# EAGLE design light_sensor (EAGLE 7.3.0)
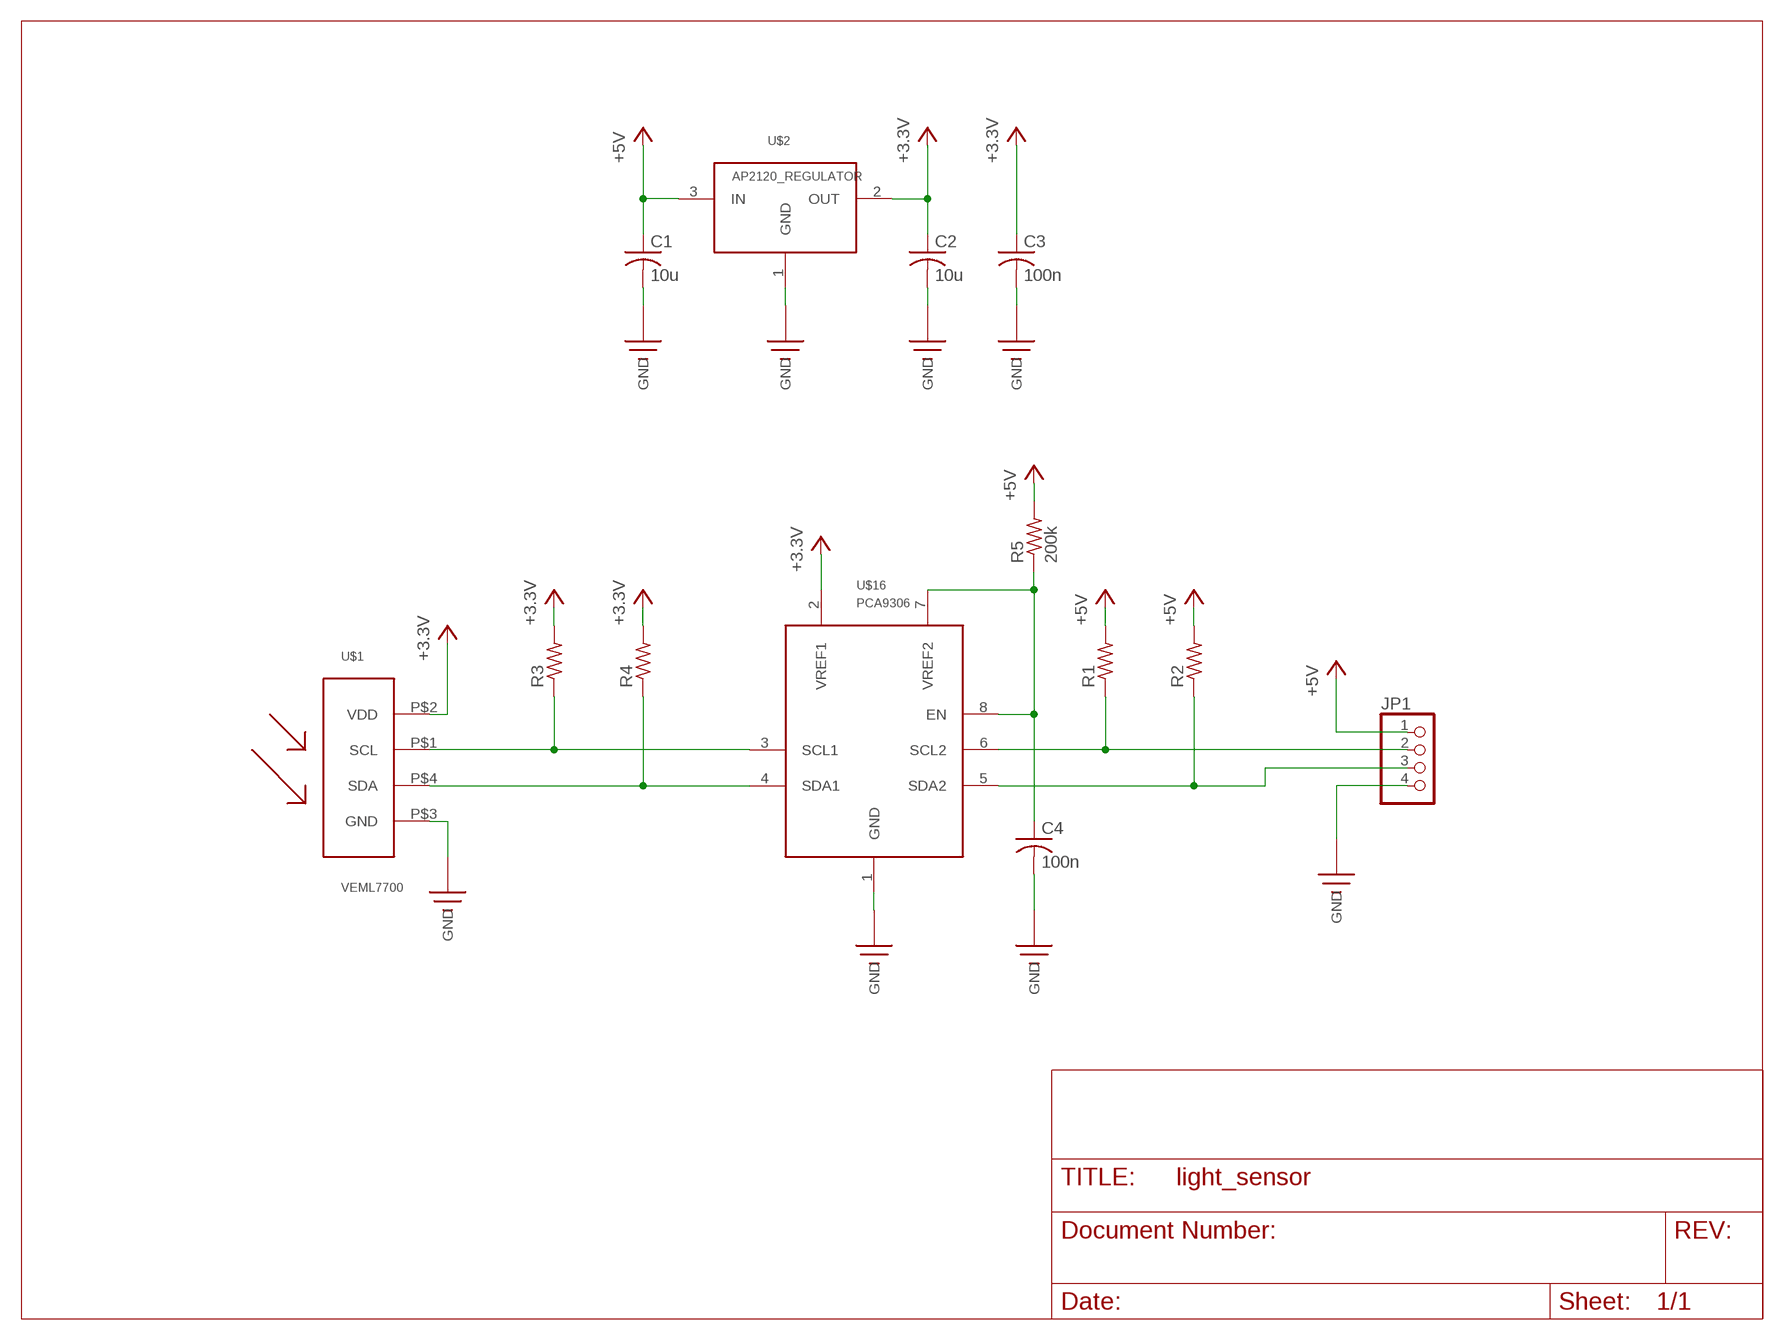
[diagram p0: schematic, sheet 1]

## Parts
C1  10u  C-USC1206K  [C1206K]
C2  10u  C-USC1206K  [C1206K]
C3  100n  C-USC0603K  [C0603K]
C4  100n  C-USC0603K  [C0603K]
JP1  PINHD-1X4  [1X04]
R1  R-US_R0603  [R0603]
R2  R-US_R0603  [R0603]
R3  R-US_R0603  [R0603]
R4  R-US_R0603  [R0603]
R5  200k  R-US_R0603  [R0603]
U$1  VEML7700  [VEML7700_SIDE]
U$2  AP2120_REGULATOR  [SOT23]
U$16  PCA9306  [SO08]

## Nets
+3.3V: C2.1 C3.1 R3.2 R4.2 U$1.P$2(VDD) U$2.2(OUT) U$16.2(VREF1)
+5V: C1.1 JP1.1 R1.2 R2.2 R5.2 U$2.3(IN)
GND: C1.2 C2.2 C3.2 C4.2 JP1.4 U$1.P$3(GND) U$2.1(GND) U$16.1(GND)
N$1: R4.1 U$1.P$4(SDA) U$16.4(SDA1)
N$2: R3.1 U$1.P$1(SCL) U$16.3(SCL1)
N$3: JP1.3 R2.1 U$16.5(SDA2)
N$4: JP1.2 R1.1 U$16.6(SCL2)
N$5: C4.1 R5.1 U$16.7(VREF2) U$16.8(EN)

## Library data of the parts
C1-C4 = z0:C-US: CAPACITOR, American symbol
JP1 = z0:PINHD-1X4: PIN HEADER
R1-R5 = z0:R-US_: RESISTOR, American symbol
U$1 = z0:VEML7700
U$2 = z0:AP2120_REGULATOR
U$16 = z0:PCA9306

## Board
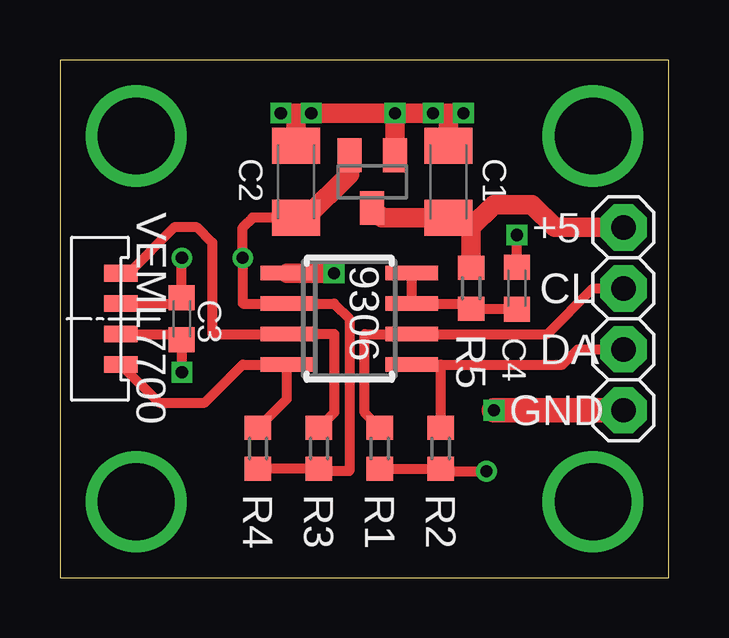
[diagram p1: board, top side]
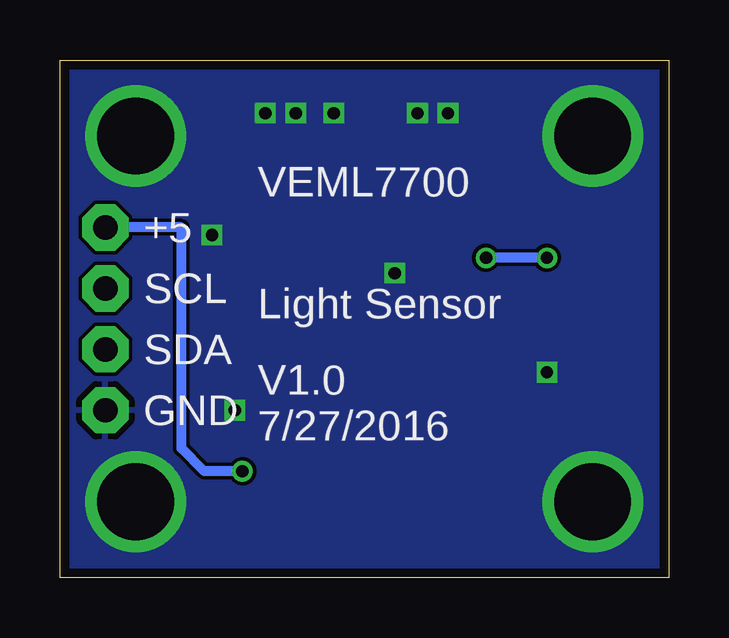
[diagram p2: board, bottom side, seen from below]

Size 25.39 x 21.58 mm. Coordinates in mm from the lower left corner, seen from the top.
Outline: 0,0 25.39,0 25.39,21.58 0,21.58 0,0
Copper layers (1*16): Top 0.0356mm / dielectric 1.5011mm / Bottom 0.0356mm
Design rules "LaenPCBOrder": minimum track width 6mil, minimum drill 13mil, track to track 6mil, track to pad 6mil, pad to pad 6mil, via to via 6mil, smd to smd 6mil, copper to edge 15mil, drill to drill 6mil, minimum pad ring 7mil, minimum via ring 7mil, stop-mask expansion 3mil, vias tented up to drill 0mil, thermal gap 10mil

### Footprints (pad centres in the part's own frame; a part is rotated, then mirrored left to right if it is on the bottom)
C1206K = smd 1.5 x 2: 1 -1.5,0; 2 1.5,0
C0603K = smd 1.05 x 1.08: 1 -0.875,0; 2 0.875,0
1X04 = drill 1.016 pad 1.93 octagon: 1 -3.81,0; 2 -1.27,0; 3 1.27,0; 4 3.81,0
R0603 = smd 1 x 1.1: 1 -0.85,0; 2 0.85,0
VEML7700_SIDE = smd 0.7 x 1.4: P$1 -1.905,0; P$2 -0.635,0; P$3 0.635,0; P$4 1.905,0
SOT23 = smd 1 x 1.4: 1 -0.95,-1.1; 2 0.95,-1.1; 3 0,1.1
SO08 = smd 0.6 x 2.2: 1 -1.905,-2.6; 2 -0.635,-2.6; 3 0.635,-2.6; 4 1.905,-2.6; 5 1.905,2.6; 6 0.635,2.6; 7 -0.635,2.6; 8 -1.905,2.6

### Placement (x,y rotation side)
C1  16.19,16.51 90 top
C2  9.84,16.51 90 top
C3  5.08,10.79 270 top
C4  19.05,12.06 90 top
JP1  23.5,10.79 270 top
R1  13.34,5.4 270 top
R2  15.88,5.4 270 top
R3  10.79,5.4 270 top
R4  8.26,5.4 270 top
R5  17.14,12.06 90 top
U$1  2.54,10.79 270 top
U$2  13.02,16.51 180 top
U$16  12.06,10.79 270 top

### Tracks (layer width: path | path; a pad name or v marks a point on that pad's centre or on a via)
+3.3V  (via drill 0.51)
  Top 0.406: U$1.P$2 5.08,11.43 C3.1 v5.08,13.34 | C2.1 8.03,15.01 7.62,14.61 v7.62,13.34 7.62,11.43 U$16.2 11.43,11.43 12.06,10.79 12.06,4.45 10.9,4.45 R3.2 R4.2
  Top 0.813: C2.1 10.25,15.01 12.06,16.83 U$2.2
  Bottom 0.406: v5.08,13.34 v7.62,13.34
+5V  (via drill 0.51)
  Top 0.406: R1.2 R2.2 15.98,4.45 v17.78,4.45
  Top 0.813: 17.14,14.61 16.51,15.24 16.42,15.24 C1.1 13.42,15.01 U$2.3 | R5.2 17.14,14.61 | JP1.1 20.64,14.61 19.68,15.56 18.1,15.56 17.14,14.61
  Bottom 0.406: v17.78,4.45 19.37,4.45 20.32,5.4 20.32,14.61 JP1.1
GND  (via drill 0.51, 3.2)
  Top 0.406: U$1.P$3 5.08,10.16 C3.2 v5.08,8.57 | C4.2 v19.05,14.29
  Top 0.813: 9.84,19.37 v10.48,19.37 v13.97,19.37 | C2.2 9.84,19.37 | 9.84,19.37 v9.21,19.37 | C1.2 16.19,19.37 v15.56,19.37 | U$2.1 v13.97,19.37 | v13.97,19.37 v16.83,19.37 | U$16.1 v11.43,12.7
  Top 1.016: v18.1,6.99 JP1.4
  other vias: 3.17,18.41 22.23,18.41 22.23,3.17 3.17,3.17
  pour Bottom: 0,0 25.4,0 25.4,21.59 0,21.59
N$1
  Top 0.406: R4.1 9.46,7.46 U$16.4 7.62,8.89 6.03,7.3 4.13,7.3 U$1.P$4
N$2
  Top 0.406: R3.1 11.43,6.88 11.43,10.16 U$16.3 6.35,10.16 6.35,13.97 5.71,14.61 4.76,14.61 2.86,12.7 U$1.P$1
N$3
  Top 0.406: U$16.5 15.88,8.89 | 15.88,8.89 20.95,8.89 21.59,9.53 JP1.3 | R2.1 15.88,8.89
N$4
  Top 0.406: JP1.2 22.23,12.06 20.32,10.16 U$16.6 12.7,10.16 12.7,6.88 R1.1
N$5
  Top 0.406: U$16.8 U$16.7 16.93,11.43 R5.1 19.02,11.21 C4.1

### Text on the board
tPlace: VEML7700 | +5 | 9306 | CL | DA | GND
bPlace: VEML7700 | +5 | Light Sensor | SCL | SDA | V1.0 | 7/27/2016 | GND